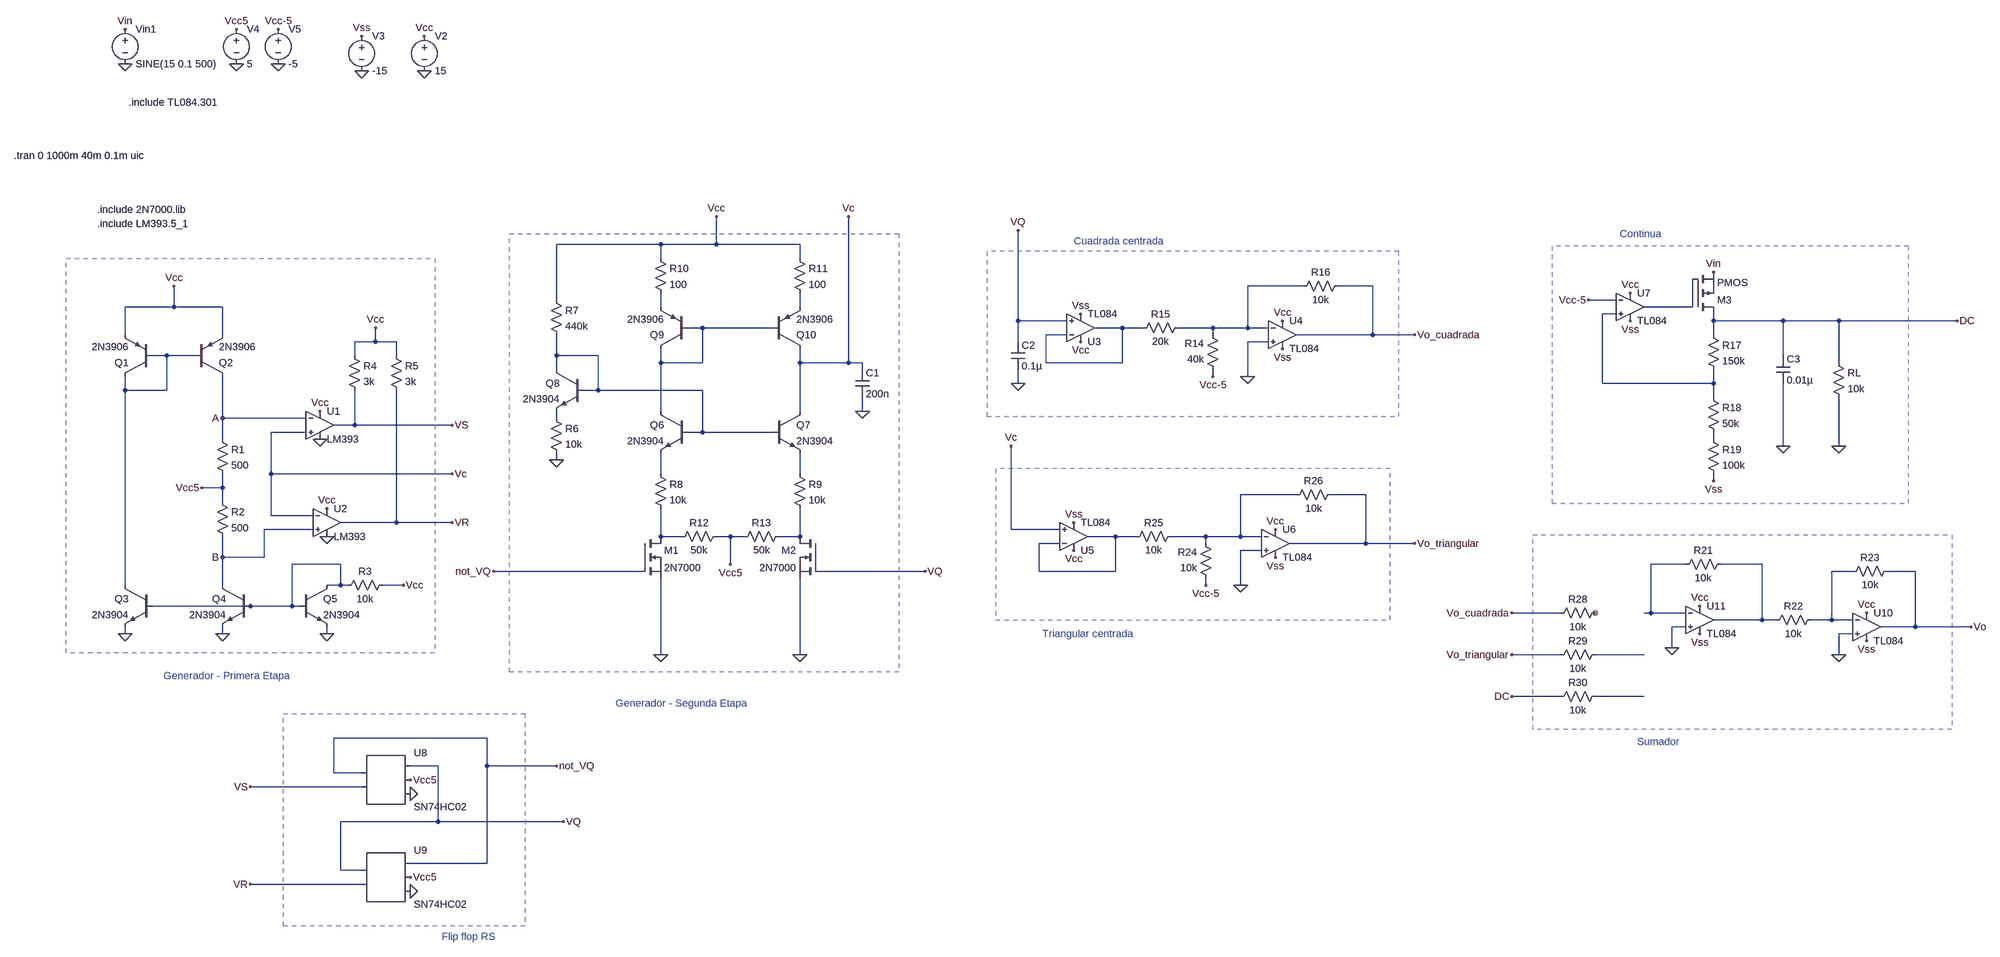
[diagram p0: schematic CIRCUITO_FINAL_PROLIJO.asc]
CIRCUITO_FINAL_PROLIJO.asc, the LTspice schematic file:
Version 4
SHEET 1 4360 2064
WIRE 720 -176 480 -176
WIRE 848 -176 848 -240
WIRE 848 -176 720 -176
WIRE 1040 -176 848 -176
WIRE 720 -144 720 -176
WIRE 1040 -144 1040 -176
WIRE 2208 -80 2080 -80
WIRE 2368 -80 2288 -80
WIRE 480 -48 480 -176
WIRE 2928 -48 2864 -48
WIRE -400 -32 -400 -80
WIRE -400 -32 -512 -32
WIRE -288 -32 -400 -32
WIRE 720 -32 720 -64
WIRE 1040 -32 1040 -64
WIRE 3104 -32 3104 -96
WIRE 3104 -32 2992 -32
WIRE 2928 -16 2896 -16
WIRE 1552 0 1552 -208
WIRE 1664 0 1552 0
WIRE 3152 0 3152 -16
WIRE 3312 0 3152 0
WIRE 3440 0 3312 0
WIRE 3712 0 3440 0
WIRE 816 16 784 16
WIRE 976 16 816 16
WIRE 1792 16 1728 16
WIRE 1840 16 1792 16
WIRE 2000 16 1920 16
WIRE 2080 16 2080 -80
WIRE 2080 16 2000 16
WIRE 2128 16 2080 16
WIRE -512 32 -512 -32
WIRE -288 32 -288 -32
WIRE 1664 32 1616 32
WIRE 2000 32 2000 16
WIRE 2368 32 2368 -80
WIRE 2368 32 2192 32
WIRE 2464 32 2368 32
WIRE 3152 32 3152 0
WIRE 64 48 64 16
WIRE 64 48 16 48
WIRE 112 48 64 48
WIRE 1552 48 1552 0
WIRE 2128 48 2080 48
WIRE -416 80 -448 80
WIRE -352 80 -416 80
WIRE 16 80 16 48
WIRE 112 80 112 48
WIRE 480 80 480 32
WIRE 576 80 480 80
WIRE 3312 80 3312 0
WIRE 720 96 720 64
WIRE 816 96 816 16
WIRE 816 96 720 96
WIRE 1040 96 1040 64
WIRE 1152 96 1152 -240
WIRE 1152 96 1040 96
WIRE 1184 96 1152 96
WIRE 1616 96 1616 32
WIRE 1792 96 1792 16
WIRE 1792 96 1616 96
WIRE 3440 96 3440 0
WIRE 480 112 480 80
WIRE 1184 112 1184 96
WIRE 2000 128 2000 112
WIRE 2080 128 2080 48
WIRE 1552 144 1552 112
WIRE 2896 144 2896 -16
WIRE 3152 144 3152 112
WIRE 3152 144 2896 144
WIRE -512 160 -512 128
WIRE -416 160 -416 80
WIRE -416 160 -512 160
WIRE 576 160 576 80
WIRE 576 160 544 160
WIRE 816 160 576 160
WIRE 3152 176 3152 144
WIRE 720 208 720 96
WIRE 1040 208 1040 96
WIRE 1184 208 1184 176
WIRE -288 224 -288 128
WIRE -96 224 -288 224
WIRE 480 224 480 208
WIRE 16 240 16 160
WIRE 16 240 -32 240
WIRE 240 240 16 240
WIRE -96 256 -176 256
WIRE 816 256 816 160
WIRE 816 256 784 256
WIRE 976 256 816 256
WIRE -288 272 -288 224
WIRE 3152 272 3152 256
WIRE 3312 288 3312 144
WIRE 3440 288 3440 176
WIRE 480 320 480 304
WIRE -176 352 -176 256
WIRE 240 352 -176 352
WIRE 720 352 720 304
WIRE 1040 352 1040 304
WIRE 3152 368 3152 352
WIRE -288 384 -288 352
WIRE -288 384 -336 384
WIRE 2192 400 2064 400
WIRE 2352 400 2272 400
WIRE -288 416 -288 384
WIRE -176 448 -176 352
WIRE -80 448 -176 448
WIRE 112 464 112 160
WIRE 112 464 -16 464
WIRE 240 464 112 464
WIRE -80 480 -192 480
WIRE 1536 480 1536 288
WIRE 1648 480 1536 480
WIRE 720 496 720 432
WIRE 768 496 720 496
WIRE 880 496 848 496
WIRE 912 496 880 496
WIRE 1040 496 1040 432
WIRE 1040 496 992 496
WIRE 1776 496 1712 496
WIRE 1824 496 1776 496
WIRE 1984 496 1904 496
WIRE 2064 496 2064 400
WIRE 2064 496 1984 496
WIRE 2112 496 2064 496
WIRE 1648 512 1600 512
WIRE 1984 512 1984 496
WIRE 2352 512 2352 400
WIRE 2352 512 2176 512
WIRE 2464 512 2352 512
WIRE 2112 528 2064 528
WIRE -288 544 -288 496
WIRE -192 544 -192 480
WIRE -192 544 -288 544
WIRE -16 560 -128 560
WIRE 880 560 880 496
WIRE 3088 560 3008 560
WIRE 3264 560 3168 560
WIRE 672 576 336 576
WIRE 1328 576 1088 576
WIRE 1600 576 1600 512
WIRE 1776 576 1776 496
WIRE 1776 576 1600 576
WIRE 3472 576 3424 576
WIRE 3616 576 3552 576
WIRE -512 608 -512 160
WIRE -288 608 -288 544
WIRE -16 608 -16 560
WIRE -16 608 -48 608
WIRE 0 608 -16 608
WIRE 128 608 80 608
WIRE 1984 608 1984 592
WIRE 2064 608 2064 528
WIRE -224 656 -448 656
WIRE -128 656 -128 560
WIRE -128 656 -224 656
WIRE -112 656 -128 656
WIRE 2800 672 2688 672
WIRE 3008 672 3008 560
WIRE 3008 672 2992 672
WIRE 3088 672 3008 672
WIRE 3264 688 3264 560
WIRE 3264 688 3152 688
WIRE 3296 688 3264 688
WIRE 3424 688 3424 576
WIRE 3424 688 3376 688
WIRE 3472 688 3424 688
WIRE 3088 704 3056 704
WIRE 3616 704 3616 576
WIRE 3616 704 3536 704
WIRE 3744 704 3616 704
WIRE -512 720 -512 704
WIRE -288 720 -288 704
WIRE -48 720 -48 704
WIRE 3472 720 3440 720
WIRE 3056 752 3056 704
WIRE 720 768 720 592
WIRE 1040 768 1040 592
WIRE 2800 768 2688 768
WIRE 2992 768 2880 768
WIRE 3440 768 3440 720
WIRE 2800 864 2688 864
WIRE 2992 864 2880 864
WIRE 320 960 -32 960
WIRE 208 1024 144 1024
WIRE 320 1024 320 960
WIRE 480 1024 320 1024
WIRE -32 1040 -32 960
WIRE 32 1040 -32 1040
WIRE 32 1072 -224 1072
WIRE 208 1152 208 1024
WIRE 208 1152 -16 1152
WIRE 496 1152 208 1152
WIRE 320 1248 320 1024
WIRE 320 1248 144 1248
WIRE -16 1264 -16 1152
WIRE 32 1264 -16 1264
WIRE 32 1296 -224 1296
FLAG -48 720 0
FLAG -288 720 0
FLAG -512 720 0
FLAG 480 320 0
FLAG 1184 208 0
FLAG 848 -240 Vcc
FLAG 880 560 Vcc5
FLAG 1040 768 0
FLAG 720 768 0
FLAG -400 -80 Vcc
FLAG 128 608 Vcc
FLAG 240 240 VS
FLAG 240 464 VR
FLAG -336 384 Vcc5
FLAG 240 352 Vc
FLAG 1328 576 VQ
FLAG 336 576 not_VQ
FLAG 1152 -240 Vc
FLAG 176 -800 Vcc
FLAG 32 -800 Vss
FLAG 32 -720 0
FLAG 176 -720 0
FLAG -256 -816 Vcc5
FLAG -256 -736 0
FLAG -160 -736 0
FLAG -160 -816 Vcc-5
FLAG -512 -816 Vin
FLAG -512 -736 0
FLAG -64 208 Vcc
FLAG -64 272 0
FLAG -48 432 Vcc
FLAG -48 496 0
FLAG 64 16 Vcc
FLAG -288 224 A
FLAG -288 544 B
FLAG 1696 48 Vcc
FLAG 1696 -16 Vss
FLAG 1552 144 0
FLAG 2000 128 Vcc-5
FLAG 2080 128 0
FLAG 1552 -208 VQ
FLAG 2464 32 Vo_cuadrada
FLAG 3744 704 Vo
FLAG 3056 752 0
FLAG 3440 768 0
FLAG 2160 0 Vcc
FLAG 2160 64 Vss
FLAG 1680 528 Vcc
FLAG 1680 464 Vss
FLAG 1984 608 Vcc-5
FLAG 2064 608 0
FLAG 1536 288 Vc
FLAG 2464 512 Vo_triangular
FLAG 2144 480 Vcc
FLAG 2144 544 Vss
FLAG 3504 672 Vcc
FLAG 3504 736 Vss
FLAG 3120 656 Vcc
FLAG 3120 720 Vss
FLAG -224 1072 VS
FLAG -224 1296 VR
FLAG 144 1280 Vcc5
FLAG 144 1312 0
FLAG 144 1088 0
FLAG 144 1056 Vcc5
FLAG 496 1152 VQ
FLAG 480 1024 not_VQ
FLAG 2688 672 Vo_cuadrada
FLAG 2688 768 Vo_triangular
FLAG 2688 864 DC
FLAG 2864 -48 Vcc-5
FLAG 3312 288 0
FLAG 3712 0 DC
FLAG 2960 -64 Vcc
FLAG 2960 0 Vss
FLAG 3152 368 Vss
FLAG 3152 -112 Vin
FLAG 3440 288 0
SYMBOL pnp -352 128 M180
SYMATTR InstName Q2
SYMATTR Value 2N3906
SYMBOL pnp -448 128 R180
SYMATTR InstName Q1
SYMATTR Value 2N3906
SYMBOL npn -448 608 M0
SYMATTR InstName Q3
SYMATTR Value 2N3904
SYMBOL res -304 256 R0
SYMATTR InstName R1
SYMATTR Value 500
SYMBOL res -304 400 R0
SYMATTR InstName R2
SYMATTR Value 500
SYMBOL npn -224 608 M0
SYMATTR InstName Q4
SYMATTR Value 2N3904
SYMBOL npn -112 608 R0
SYMATTR InstName Q5
SYMATTR Value 2N3904
SYMBOL res 96 592 R90
WINDOW 0 0 56 VBottom 2
WINDOW 3 32 56 VTop 2
SYMATTR InstName R3
SYMATTR Value 10k
SYMBOL res 864 480 R90
WINDOW 0 0 56 VBottom 2
WINDOW 3 32 56 VTop 2
SYMATTR InstName R12
SYMATTR Value 50k
SYMBOL res 1008 480 R90
WINDOW 0 0 56 VBottom 2
WINDOW 3 32 56 VTop 2
SYMATTR InstName R13
SYMATTR Value 50k
SYMBOL npn 976 208 R0
SYMATTR InstName Q7
SYMATTR Value 2N3904
SYMBOL npn 784 208 M0
SYMATTR InstName Q6
SYMATTR Value 2N3904
SYMBOL npn 544 112 M0
SYMATTR InstName Q8
SYMATTR Value 2N3904
SYMBOL res 464 208 R0
SYMATTR InstName R6
SYMATTR Value 10k
SYMBOL res 464 -64 R0
SYMATTR InstName R7
SYMATTR Value 440k
SYMBOL cap 1168 112 R0
SYMATTR InstName C1
SYMATTR Value 200n
SYMBOL pnp 784 64 R180
SYMATTR InstName Q9
SYMATTR Value 2N3906
SYMBOL pnp 976 64 M180
SYMATTR InstName Q10
SYMATTR Value 2N3906
SYMBOL voltage 176 -816 R0
WINDOW 123 0 0 Left 2
WINDOW 39 0 0 Left 2
SYMATTR InstName V2
SYMATTR Value 15
SYMBOL voltage 32 -816 R0
WINDOW 123 0 0 Left 2
WINDOW 39 0 0 Left 2
SYMATTR InstName V3
SYMATTR Value -15
SYMBOL voltage -256 -832 R0
WINDOW 123 0 0 Left 2
WINDOW 39 0 0 Left 2
SYMATTR InstName V4
SYMATTR Value 5
SYMBOL voltage -160 -832 R0
WINDOW 123 0 0 Left 2
WINDOW 39 0 0 Left 2
SYMATTR InstName V5
SYMATTR Value -5
SYMBOL voltage -512 -832 R0
WINDOW 123 0 0 Left 2
WINDOW 39 0 0 Left 2
SYMATTR InstName Vin1
SYMATTR Value SINE(15 0.1 500)
SYMBOL opamp2 -48 400 R0
SYMATTR InstName U2
SYMATTR Value LM393
SYMBOL opamp2 -64 176 R0
SYMATTR InstName U1
SYMATTR Value LM393
SYMBOL res 704 336 R0
SYMATTR InstName R8
SYMATTR Value 10k
SYMBOL res 1024 336 R0
SYMATTR InstName R9
SYMATTR Value 10k
SYMBOL res 1024 -160 R0
SYMATTR InstName R11
SYMATTR Value 100
SYMBOL res 704 -160 R0
SYMATTR InstName R10
SYMATTR Value 100
SYMBOL res 0 64 R0
SYMATTR InstName R4
SYMATTR Value 3k
SYMBOL res 96 64 R0
SYMATTR InstName R5
SYMATTR Value 3k
SYMBOL cap 1536 48 R0
SYMATTR InstName C2
SYMATTR Value 0.1µ
SYMBOL res 2016 128 R180
WINDOW 0 36 76 Left 2
WINDOW 3 36 40 Left 2
SYMATTR InstName R14
SYMATTR Value 40k
SYMBOL res 1936 0 R90
WINDOW 0 0 56 VBottom 2
WINDOW 3 32 56 VTop 2
SYMATTR InstName R15
SYMATTR Value 20k
SYMBOL res 2304 -96 R90
WINDOW 0 0 56 VBottom 2
WINDOW 3 32 56 VTop 2
SYMATTR InstName R16
SYMATTR Value 10k
SYMBOL res 3184 544 R90
WINDOW 0 0 56 VBottom 2
WINDOW 3 32 56 VTop 2
SYMATTR InstName R21
SYMATTR Value 10k
SYMBOL res 3392 672 R90
WINDOW 0 0 56 VBottom 2
WINDOW 3 32 56 VTop 2
SYMATTR InstName R22
SYMATTR Value 10k
SYMBOL res 3568 560 R90
WINDOW 0 0 56 VBottom 2
WINDOW 3 32 56 VTop 2
SYMATTR InstName R23
SYMATTR Value 10k
SYMBOL opamp2 1696 80 M180
SYMATTR InstName U3
SYMATTR Value TL084
SYMBOL opamp2 2160 -32 R0
SYMATTR InstName U4
SYMATTR Value TL084
SYMBOL res 2000 608 R180
WINDOW 0 36 76 Left 2
WINDOW 3 36 40 Left 2
SYMATTR InstName R24
SYMATTR Value 10k
SYMBOL res 1920 480 R90
WINDOW 0 0 56 VBottom 2
WINDOW 3 32 56 VTop 2
SYMATTR InstName R25
SYMATTR Value 10k
SYMBOL res 2288 384 R90
WINDOW 0 0 56 VBottom 2
WINDOW 3 32 56 VTop 2
SYMATTR InstName R26
SYMATTR Value 10k
SYMBOL opamp2 1680 560 M180
SYMATTR InstName U5
SYMATTR Value TL084
SYMBOL opamp2 2144 448 R0
SYMATTR InstName U6
SYMATTR Value TL084
SYMBOL opamp2 3504 640 R0
SYMATTR InstName U10
SYMATTR Value TL084
SYMBOL opamp2 3120 624 R0
SYMATTR InstName U11
SYMATTR Value TL084
SYMBOL nmos 672 496 R0
SYMATTR InstName M1
SYMATTR Value 2N7000
SYMATTR Prefix X
SYMBOL nmos 1088 496 M0
SYMATTR InstName M2
SYMATTR Value 2N7000
SYMATTR Prefix X
SYMBOL res 2896 656 R90
WINDOW 0 0 56 VBottom 2
WINDOW 3 32 56 VTop 2
SYMATTR InstName R28
SYMATTR Value 10k
SYMBOL res 2896 752 R90
WINDOW 0 0 56 VBottom 2
WINDOW 3 32 56 VTop 2
SYMATTR InstName R29
SYMATTR Value 10k
SYMBOL res 2896 848 R90
WINDOW 0 0 56 VBottom 2
WINDOW 3 32 56 VTop 2
SYMATTR InstName R30
SYMATTR Value 10k
SYMBOL cap 3296 80 R0
SYMATTR InstName C3
SYMATTR Value 0.01µ
SYMBOL res 3136 16 R0
SYMATTR InstName R17
SYMATTR Value 150k
SYMBOL res 3136 160 R0
SYMATTR InstName R18
SYMATTR Value 50k
SYMBOL pmos 3104 -16 M180
SYMATTR InstName M3
SYMBOL opamp2 2960 -96 R0
SYMATTR InstName U7
SYMATTR Value TL084
SYMBOL res 3136 256 R0
SYMATTR InstName R19
SYMATTR Value 100k
SYMBOL AutoGenerated/SN74HC02 80 1056 R0
SYMATTR InstName U8
SYMBOL AutoGenerated/SN74HC02 80 1280 R0
SYMATTR InstName U9
SYMBOL res 3424 80 R0
SYMATTR InstName RL
SYMATTR Value 10k
TEXT -424 816 Left 2 ;Generador - Primera Etapa
TEXT 616 880 Left 2 ;Generador - Segunda Etapa
TEXT -768 -512 Left 2 !.tran 0 1000m 40m 0.1m uic
TEXT -504 -648 Left 2 !.include TL084.301
TEXT -576 -224 Left 2 !.include LM393.5_1
TEXT 1608 720 Left 2 ;Triangular centrada
TEXT 1680 -184 Left 2 ;Cuadrada centrada
TEXT 2976 968 Left 2 ;Sumador
TEXT 216 1416 Left 2 ;Flip flop RS
TEXT -576 -256 Left 2 !.include 2N7000.lib
TEXT 2936 -200 Left 2 ;Continua
RECTANGLE Normal 372 -200 1268 808 2
RECTANGLE Normal -648 -144 200 764 2
RECTANGLE Normal -148 904 408 1392 2
RECTANGLE Normal 3600 -172 2780 420 2
RECTANGLE Normal 2736 492 3700 940 2
RECTANGLE Normal 2428 -160 1480 220 2
RECTANGLE Normal 2408 340 1500 688 2

The netlist it stands for:
* CIRCUITO_FINAL_PROLIJO.asc
Q2 A N008 Vcc 0 2N3906
Q1 N008 N008 Vcc 0 2N3906
Q3 N008 N018 0 0 2N3904
R1 A Vcc5 500
R2 Vcc5 B 500
Q4 B N018 0 0 2N3904
Q5 N018 N018 0 0 2N3904
R3 Vcc N018 10k
R12 Vcc5 N015 50k
R13 N016 Vcc5 50k
Q7 Vc N009 N013 0 2N3904
Q6 N006 N009 N012 0 2N3904
Q8 N009 N009 N010 0 2N3904
R6 N010 0 10k
R7 Vcc N009 440k
C1 Vc 0 200n
Q9 N006 N006 N002 0 2N3906
Q10 Vc N006 N003 0 2N3906
V2 Vcc 0 15
V3 Vss 0 -15
V4 Vcc5 0 5
V5 Vcc-5 0 -5
Vin1 Vin 0 SINE(15 0.1 500)
XU2 B Vc Vcc 0 VR LM393  ; pins In+ In- V+ V- OUT
XU1 Vc A Vcc 0 VS LM393  ; pins In+ In- V+ V- OUT
R8 N012 N015 10k
R9 N013 N016 10k
R11 Vcc N003 100
R10 Vcc N002 100
R4 Vcc VS 3k
R5 Vcc VR 3k
C2 VQ 0 0.1µ
R14 Vcc-5 N001 40k
R15 N001 N007 20k
R16 Vo_cuadrada N001 10k
R21 N020 N019 10k
R22 N021 N020 10k
R23 Vo N021 10k
XU3 VQ N007 Vcc Vss N007 TL084  ; pins In+ In- V+ V- OUT
XU4 0 N001 Vcc Vss Vo_cuadrada TL084  ; pins In+ In- V+ V- OUT
R24 Vcc-5 N014 10k
R25 N014 N017 10k
R26 Vo_triangular N014 10k
XU5 Vc N017 Vcc Vss N017 TL084  ; pins In+ In- V+ V- OUT
XU6 0 N014 Vcc Vss Vo_triangular TL084  ; pins In+ In- V+ V- OUT
XU10 0 N021 Vcc Vss Vo TL084  ; pins In+ In- V+ V- OUT
XU11 0 N019 Vcc Vss N020 TL084  ; pins In+ In- V+ V- OUT
XM1 N015 not_VQ 0 2N7000  ; pins D G S
XM2 N016 VQ 0 2N7000  ; pins D G S
R28 NC_01 Vo_cuadrada 10k
R29 N022 Vo_triangular 10k
R30 N023 DC 10k
C3 DC 0 0.01µ
R17 DC N005 150k
R18 N005 N011 50k
M3 DC N004 Vin Vin PMOS
XU7 N005 Vcc-5 Vcc Vss N004 TL084  ; pins In+ In- V+ V- OUT
R19 N011 Vss 100k
* U8: SN74HC02 (symbol AutoGenerated/SN74HC02 not available, pins judged from their places): pin1=not_VQ pin2=VS pin3=VQ pin4=Vcc5 pin5=0
* U9: SN74HC02 (symbol AutoGenerated/SN74HC02 not available, pins judged from their places): pin1=VQ pin2=VR pin3=not_VQ pin4=Vcc5 pin5=0
RL DC 0 10k
.model NPN NPN
.model PNP PNP
.lib standard.bjt
.model NMOS NMOS
.model PMOS PMOS
.lib standard.mos
* Generador - Primera Etapa
* Generador - Segunda Etapa
.tran 0 1000m 40m 0.1m uic
.include TL084.301
.include LM393.5_1
* Triangular centrada
* Cuadrada centrada
* Sumador
* Flip flop RS
.include 2N7000.lib
* Continua
.backanno
.end